# EAGLE schematic can logger pcb (EAGLE 9.7.0)
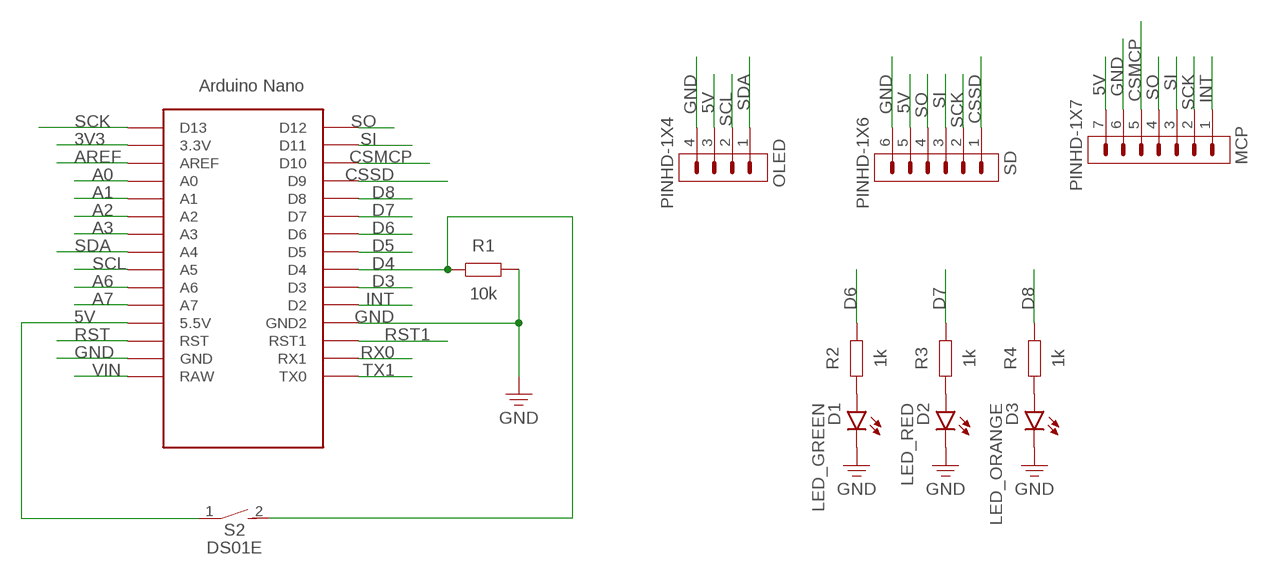
[diagram p0: schematic, sheet 1]

## Parts
D1  LED_GREEN  LED_RADIAL_GREEN  [LEDRD254W60D565H860B_G]
D2  LED_RED  LED_RADIAL_RED  [LEDRD254W60D565H860B]
D3  LED_ORANGE  LED_RADIAL_ORANGE  [LEDRD254W60D565H860B_O]
MCP  PINHD-1X7  [1X07]
OLED  PINHD-1X4  [1X04]
R1  10k  R_AXIAL-11.7MM-PITCH  [RESAD1176W63L850D250B]
R2  1k  R_AXIAL-11.7MM-PITCH  [RESAD1176W63L850D250B]
R3  1k  R_AXIAL-11.7MM-PITCH  [RESAD1176W63L850D250B]
R4  1k  R_AXIAL-11.7MM-PITCH  [RESAD1176W63L850D250B]
S2  DS01E  [DS-01]
SD  PINHD-1X6  [1X06]
U$2  NANO  [NANO]

## Nets
3V3: U$2.3.3V
5V: MCP.7 OLED.3 S2.1 SD.5 U$2.5V(5.5V)
A0: U$2.A0
A1: U$2.A1
A2: U$2.A2
A3: U$2.A3
A6: U$2.A6
A7: U$2.A7
AREF: U$2.AREF
CSMCP: MCP.5 U$2.D10
CSSD: SD.1 U$2.D9
D3: U$2.D3
D4: R1.1 S2.2 U$2.D4
D5: U$2.D5
D6: R2.2 U$2.D6
D7: R3.2 U$2.D7
D8: R4.2 U$2.D8
GND: D1.2(C) D2.2(C) D3.2(C) MCP.6 OLED.4 R1.2 SD.6 U$2.GND U$2.GND1(GND2)
INT: MCP.1 U$2.D2
N$3: D1.1(A) R2.1
N$4: D2.1(A) R3.1
N$5: D3.1(A) R4.1
RST: U$2.RST
RST1: U$2.RST1
RX0: U$2.RX1
SCK: MCP.2 SD.2 U$2.D13
SCL: OLED.2 U$2.A5
SDA: OLED.1 U$2.A4
SI: MCP.3 SD.3 U$2.D11
SO: MCP.4 SD.4 U$2.D12
TX1: U$2.TX0
VIN: U$2.RAW
Unconnected: U$2.ICSP1 U$2.ICSP2 U$2.ICSP3 U$2.ICSP4 U$2.ICSP5 U$2.ICSP6

## Library data of the parts
D1-D3 = Tinkercad:LED_RADIAL: LED - Generic; CATEGORY: Opto-Electronic; SUB-CATEGORY: LED
MCP = Connector:PINHD-1X7: Pin Header; CATEGORY: Connectors; DESCRIPTION: Header-Straight-7 Position; PACKAGE_TYPE: Through Hole; PITCH: 0.100" (2.54mm); SUBCATEGORY: Headers; TYPE: Male Pins
OLED = Connector:PINHD-1X4: Pin Header; CATEGORY: Connectors; DESCRIPTION: Header-Straight-4 Position; PACKAGE_TYPE: Through Hole; PITCH: 0.100" (2.54mm); SUBCATEGORY: Headers; TYPE: Male Pins
R1-R4 = Resistor:R: Resistor Fixed - Generic; CATEGORY: Resistors; DESCRIPTION: Axial Resistor 11.76 mm pitch 8.5 mm body length 2.5 mm body diameter; PACKAGE_SIZE: Axial; PACKAGE_TYPE: Through Hole
S2 = Switch:DS01E: DIL/CODE Switch; CATEGORY: Switches; MANUFACTURER: Multicomp Pro; OPERATING_TEMPERATURE: -40°C ~ 85°C; PACKAGE_SIZE: NA; PACKAGE_TYPE: Through Hole; PART_STATUS: Obsolete; ROHS: Compliant; SUBCATEGORY: DIP Switches; TYPE: SPST-NO
SD = Connector:PINHD-1X6: Pin Header; CATEGORY: Connectors; DESCRIPTION: Header-Straight-6 Position; PACKAGE_TYPE: Through Hole; PITCH: 0.100" (2.54mm); SUBCATEGORY: Headers; TYPE: Male Pins
U$2 = Arduino-clone:NANO: Arduino Nano